# Altium schematic sheet VIA_MOTORS.SchDoc
size A
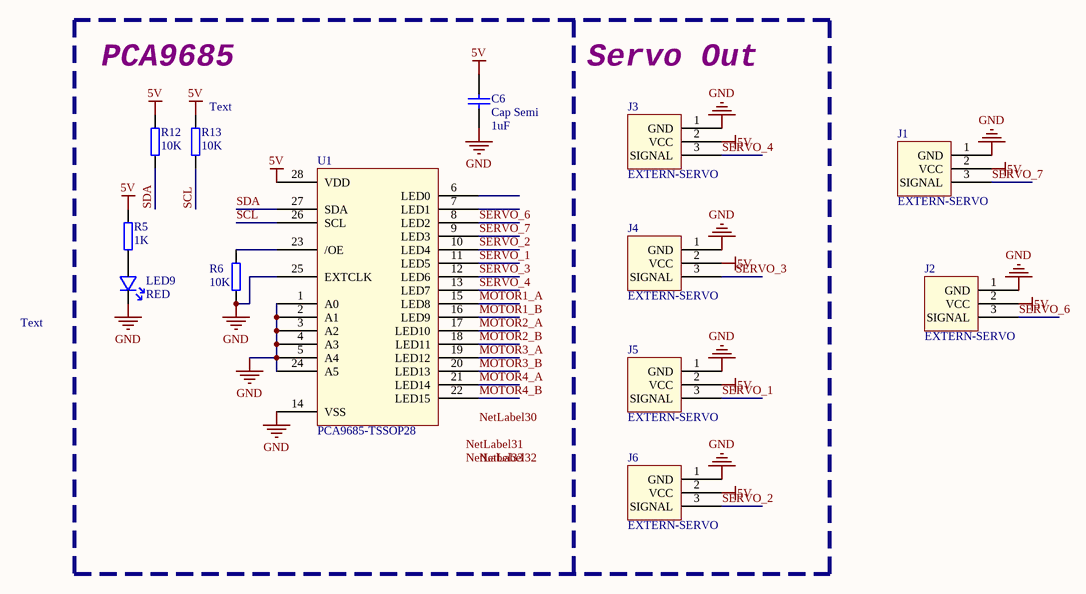
[diagram p0: VIA_MOTORS.SchDoc]

## Parts
C6  Cap Semi  value 1uF  [SMT0603]
J1  EXTERN-SERVO  [JP3H]
J2  EXTERN-SERVO  [JP3H]
J3  EXTERN-SERVO  [JP3H]
J4  EXTERN-SERVO  [JP3H]
J5  EXTERN-SERVO  [JP3H]
J6  EXTERN-SERVO  [JP3H]
LED9  RED  [SMT0603P]
R5  value 1K  [SMT0603]  (hidden comment: Resistor)
R6  value 10K  [SMT0603]  (hidden comment: Resistor)
R12  value 10K  [SMT0603]  (hidden comment: Resistor)
R13  value 10K  [SMT0603]  (hidden comment: Resistor)
U1  PCA9685-TSSOP28  [TSSOP28-SMD]

## Nets
5V: C6.2 J1.2(VCC) J2.2(VCC) J3.2(VCC) J4.2(VCC) J5.2(VCC) J6.2(VCC) R5.2 R12.2 R13.2 U1.28(VDD)
GND: C6.1 J1.1(GND) J2.1(GND) J3.1(GND) J4.1(GND) J5.1(GND) J6.1(GND) LED9.2 R6.1 U1.1(A0) U1.2(A1) U1.3(A2) U1.4(A3) U1.5(A4) U1.14(VSS) U1.24(A5) U1.25(EXTCLK)
MOTOR1_A: U1.15(LED8)
MOTOR1_B: U1.16(LED9)
MOTOR2_A: U1.17(LED10)
MOTOR2_B: U1.18(LED11)
MOTOR3_A: U1.19(LED12)
MOTOR3_B: U1.20(LED13)
MOTOR4_A: U1.21(LED14)
MOTOR4_B: U1.22(LED15)
SCL: R13.1 U1.26(SCL)
SDA: R12.1 U1.27(SDA)
SERVO_1: J5.3(SIGNAL) U1.11(LED5)
SERVO_2: J6.3(SIGNAL) U1.10(LED4)
SERVO_3: J4.3(SIGNAL) U1.12(LED6)
SERVO_4: J3.3(SIGNAL) U1.13(LED7)
SERVO_6: J2.3(SIGNAL) U1.8(LED2)
SERVO_7: J1.3(SIGNAL) U1.9(LED3)
NetLED9_1: LED9.1 R5.1
NetR6_2: R6.2 U1.23(/OE)

Not connected (* = marked no-connect by the designer): U1 6(LED0) 7(LED1)

## Notes on the sheet
- PCA9685
- (near R13) Text
- Servo Out
- Text
- Labels drawn without touching a wire or pin: NetLabel30, NetLabel31, NetLabel32, NetLabel33

## Library data of the parts
C6 = CAP-SM-0603-X7R-1uF: CAP SM 0603 X7R 1uF 10%; Tolerance: ±10%; Supplier 1: Digi-Key; Supplier 2: Farnell; Supplier Part Number 1: 490-5307-1-ND; Supplier Part Number 2: 2366834
LED9 = LNJ237W82RA: LED SM 0603 RED 1V95 FWD VOLTAGE; Supplier 1: Digi-Key; Forward Voltage: 1V95; Supplier Part Number 1: LNJ237W82RACT-ND
R5 = RES-SM-0603-1K: RES SM 0603 1K
R6 R12 R13 = RES-SM-0603-10K: RES SM 0603 10K; Supplier 1: Farnell; Supplier 2: Digi-Key; Supplier Part Number 1: 9330399; Supplier Part Number 2: 541-10.0KHCT-ND